# EAGLE design Single Turnoutv0.2 (EAGLE 8.2.2)
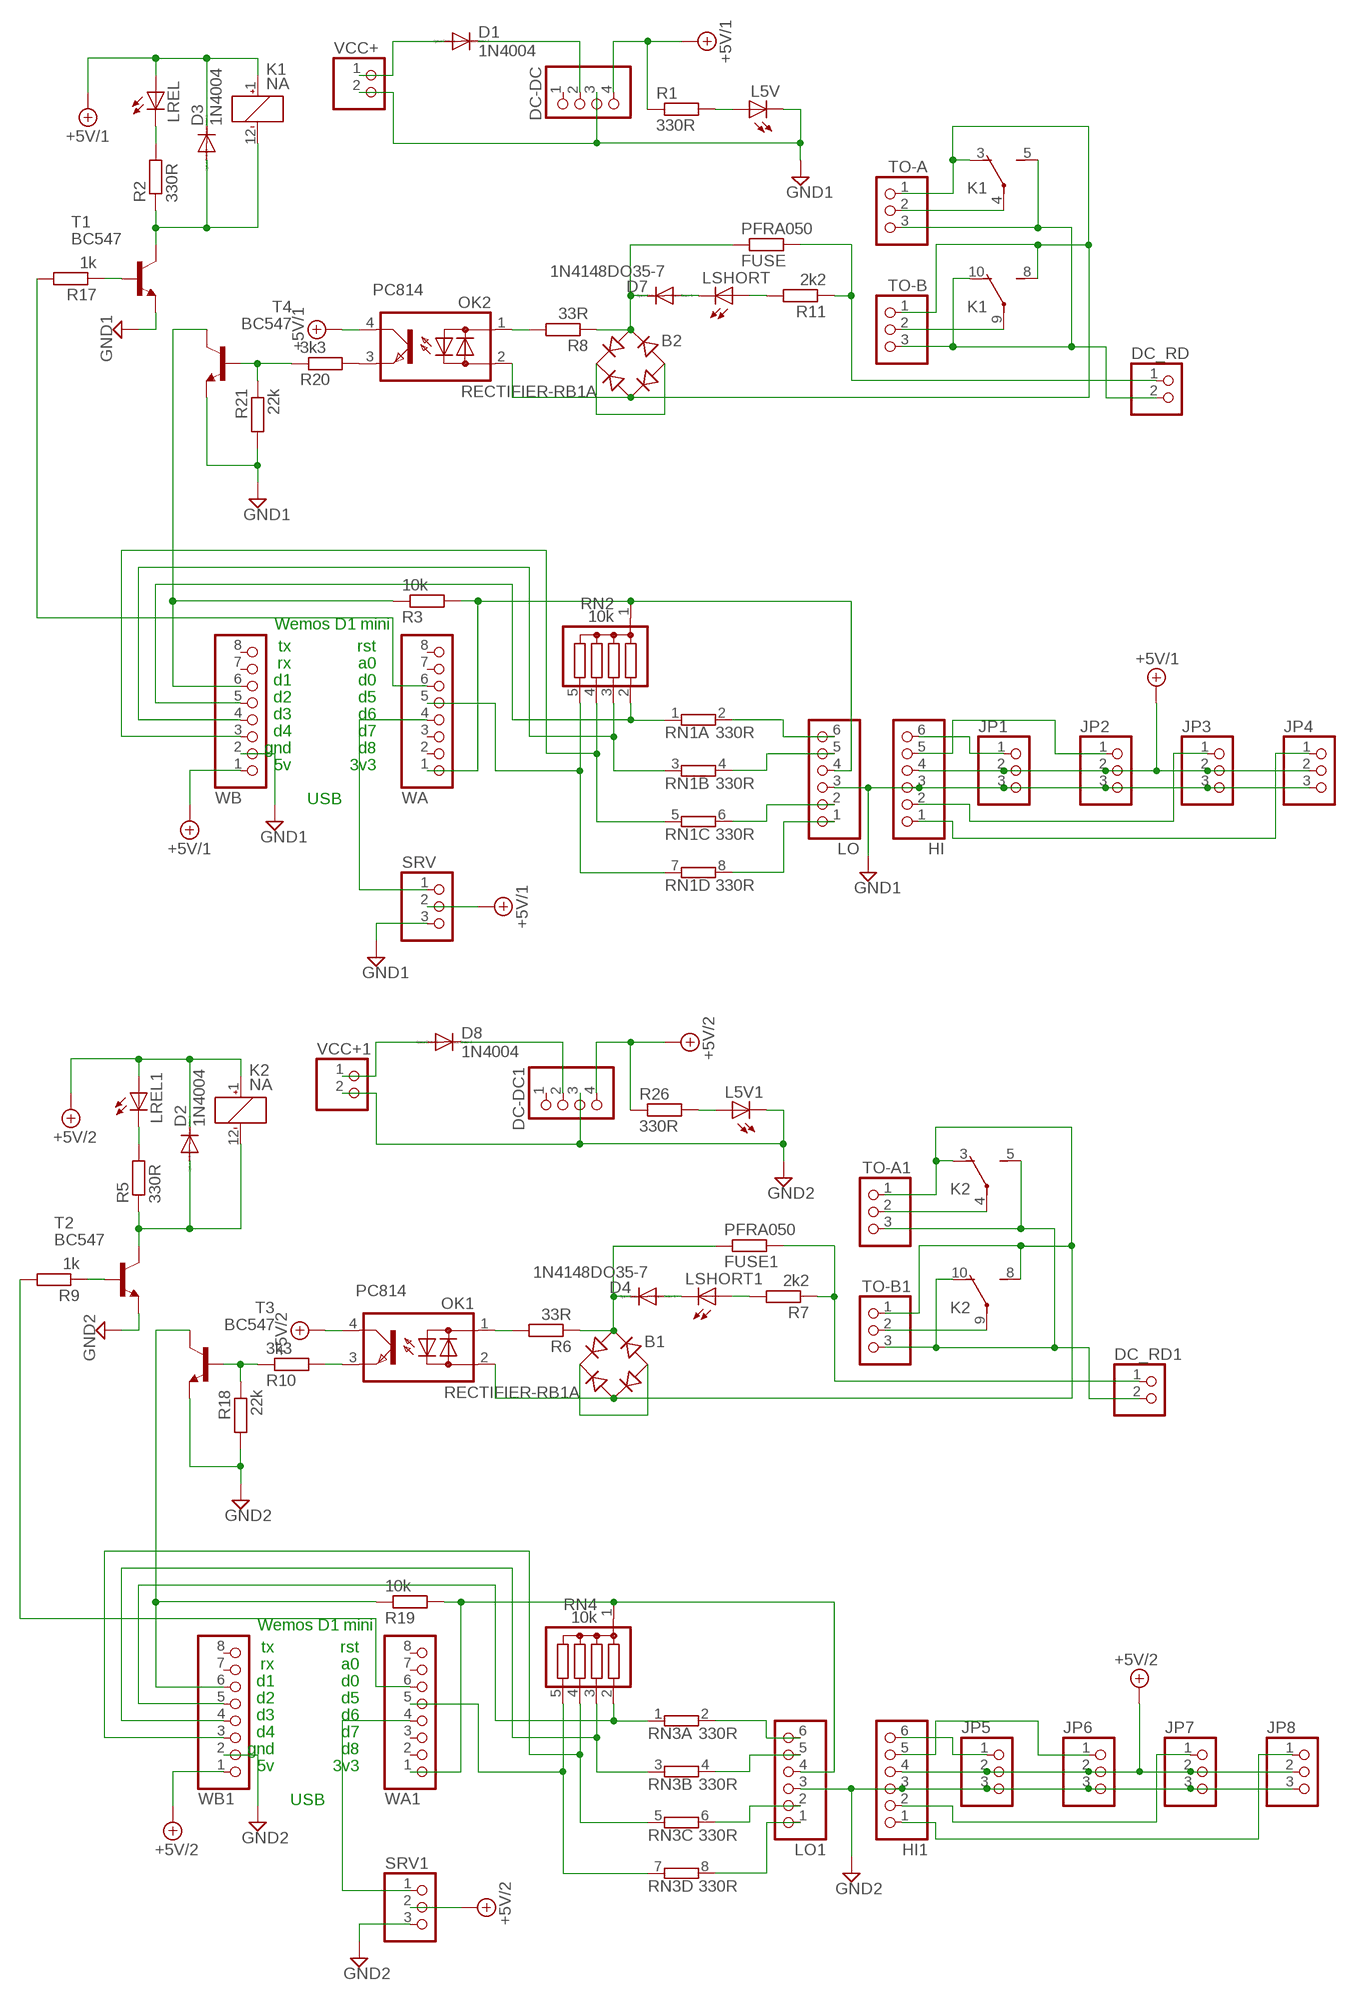
[diagram p0: schematic, sheet 1]

## Parts
B1  RECTIFIER-RB1A  [RB1A]
B2  RECTIFIER-RB1A  [RB1A]
D1  1N4004  [DO41-10]
D2  1N4004  [DO41-10]
D3  1N4004  [DO41-10]
D4  1N4148DO35-7  [DO35-7]
D7  1N4148DO35-7  [DO35-7]
D8  1N4004  [DO41-10]
DC-DC  PINHD-1X4  [1X04]
DC-DC1  PINHD-1X4  [1X04]
DC_RD  PINHD-1X2  [1X02]
DC_RD1  PINHD-1X2  [1X02]
FUSE  PFRA050  R-EU_0414/5V  [0414V]
FUSE1  PFRA050  R-EU_0414/5V  [0414V]
HI  PINHD-1X6  [1X06]
HI1  PINHD-1X6  [1X06]
JP1  PINHD-1X3  [1X03]
JP2  PINHD-1X3  [1X03]
JP3  PINHD-1X3  [1X03]
JP4  PINHD-1X3  [1X03]
JP5  PINHD-1X3  [1X03]
JP6  PINHD-1X3  [1X03]
JP7  PINHD-1X3  [1X03]
JP8  PINHD-1X3  [1X03]
K1  NA  [NA]
K2  NA  [NA]
L5V  LED3MM  [LED3MM]
L5V1  LED3MM  [LED3MM]
LO  PINHD-1X6  [1X06]
LO1  PINHD-1X6  [1X06]
LREL  LED3MM  [LED3MM]
LREL1  LED3MM  [LED3MM]
LSHORT  LED3MM  [LED3MM]
LSHORT1  LED3MM  [LED3MM]
OK1  PC814  [DIL04]
OK2  PC814  [DIL04]
R1  330R  R-EU_0207/7  [0207/7]
R2  330R  R-EU_0207/7  [0207/7]
R3  10k  R-EU_0207/7  [0207/7]
R5  330R  R-EU_0207/7  [0207/7]
R6  33R  R-EU_0207/7  [0207/7]
R7  2k2  R-EU_0207/7  [0207/7]
R8  33R  R-EU_0207/7  [0207/7]
R9  1k  R-EU_0207/7  [0207/7]
R10  3k3  R-EU_0207/7  [0207/7]
R11  2k2  R-EU_0207/7  [0207/7]
R17  1k  R-EU_0207/7  [0207/7]
R18  22k  R-EU_0207/7  [0207/7]
R19  10k  R-EU_0207/7  [0207/7]
R20  3k3  R-EU_0207/7  [0207/7]
R21  22k  R-EU_0207/7  [0207/7]
R26  330R  R-EU_0207/7  [0207/7]
RN1  330R  E4R  [SIL8]
RN2  10k  G04R  [SIL5]
RN3  330R  E4R  [SIL8]
RN4  10k  G04R  [SIL5]
SRV  PINHD-1X3  [1X03]
SRV1  PINHD-1X3  [1X03]
T1  BC547  [TO92]
T2  BC547  [TO92]
T3  BC547  [TO92]
T4  BC547  [TO92]
TO-A  PINHD-1X3  [1X03]
TO-A1  PINHD-1X3  [1X03]
TO-B  PINHD-1X3  [1X03]
TO-B1  PINHD-1X3  [1X03]
VCC+  PINHD-1X2  [1X02]
VCC+1  PINHD-1X2  [1X02]
WA  PINHD-1X8  [1X08]
WA1  PINHD-1X8  [1X08]
WB  PINHD-1X8  [1X08]
WB1  PINHD-1X8  [1X08]

## Nets
+5V/1 [5V]: D3.C DC-DC.4 HI.4 JP1.2 JP2.2 JP3.2 JP4.2 K1.1(1:+) LREL.A OK2.4(C) R1.1 SRV.2 WB.1
+5V/2 [5V]: D2.C DC-DC1.4 HI1.4 JP5.2 JP6.2 JP7.2 JP8.2 K2.1(1:+) LREL1.A OK1.4(C) R26.1 SRV1.2 WB1.1
GND1 [Gnd]: DC-DC.3 HI.3 JP1.3 JP2.3 JP3.3 JP4.3 L5V.K(C) LO.3 R21.2 SRV.3 T1.1(E) T4.1(E) VCC+.2 WB.2
GND2 [Gnd]: DC-DC1.3 HI1.3 JP5.3 JP6.3 JP7.3 JP8.3 L5V1.K(C) LO1.3 R18.2 SRV1.3 T2.1(E) T3.1(E) VCC+1.2 WB1.2
N$1 [3.3V]: LO.4 R3.2 RN2.1 WA.1
N$2: LO.6 RN1.2
N$3 [Rijstroom+]: DC_RD.1 FUSE.2 R11.1
N$4 [5V]: D1.A VCC+.1
N$5: R3.1 T4.3(C) WB.6
N$6: LREL1.K(C) R5.2
N$7: OK1.1(AC1) R6.2
N$8: LSHORT1.A R7.2
N$9: D4.A LSHORT1.K(C)
N$10: D2.A K2.12(1:-) R5.1 T2.3(C)
N$11: R9.1 T2.2(B)
N$12: LREL.K(C) R2.2
N$13 [Rijstroom+]: B1.+ B1.-
N$14 [Rijstroom+]: B2.AC2 K1.3(2:O) K1.8(3:S) OK2.2(AC2) TO-A.1 TO-B.1
N$15 [Rijstroom+]: K2.4(2:P) TO-A1.2
N$16 [Rijstroom-]: DC_RD.2 K1.5(2:S) K1.10(3:O) TO-A.3 TO-B.3
N$17: OK2.3(E) R20.2
N$18 [Rijstroom-]: K2.9(3:P) TO-B1.2
N$19 [Rijstroom+]: B1.AC2 K2.3(2:O) K2.8(3:S) OK1.2(AC2) TO-A1.1 TO-B1.1
N$20 [Rijstroom+]: B1.AC1 D4.C FUSE1.1 R6.1
N$21: OK2.1(AC1) R8.2
N$22 [Rijstroom-]: DC_RD1.2 K2.5(2:S) K2.10(3:O) TO-A1.3 TO-B1.3
N$23 [Rijstroom+]: B2.AC1 D7.C FUSE.1 R8.1
N$24: LO.5 RN1.4
N$25: HI.2 JP3.1
N$26 [Rijstroom+]: K1.4(2:P) TO-A.2
N$27 [Rijstroom+]: DC_RD1.1 FUSE1.2 R7.1
N$28: R20.1 R21.1 T4.2(B)
N$29: R17.2 WA.6
N$30: HI.5 JP2.1
N$31: SRV.1 WA.4
N$32 [Rijstroom-]: K1.9(3:P) TO-B.2
N$33: SRV1.1 WA1.4
N$34: R10.1 R18.1 T3.2(B)
N$35: LSHORT.A R11.2
N$36: HI.6 JP1.1
N$37: RN1.3 RN2.3 WB.4
N$38: RN1.1 RN2.2 WB.5
N$39: HI1.2 JP7.1
N$40: HI1.5 JP6.1
N$41: D7.A LSHORT.K(C)
N$42 [Rijstroom+]: B2.+ B2.-
N$43: HI1.6 JP5.1
N$44: RN1.5 RN2.4 WB.3
N$45: RN1.7 RN2.5 WA.5
N$46: L5V.A R1.2
N$47: RN3.5 RN4.4 WB1.3
N$48 [3.3V]: LO1.4 R19.2 RN4.1 WA1.1
N$49: R17.1 T1.2(B)
N$50: D3.A K1.12(1:-) R2.1 T1.3(C)
N$51: RN3.7 RN4.5 WA1.5
N$52: HI1.1 JP8.1
N$53: LO.2 RN1.6
N$54: RN3.3 RN4.3 WB1.4
N$55: RN3.1 RN4.2 WB1.5
N$56: LO.1 RN1.8
N$57: LO1.6 RN3.2
N$58 [5V]: D1.C DC-DC.2
N$59: LO1.5 RN3.4
N$60: LO1.2 RN3.6
N$61: HI.1 JP4.1
N$62: R9.2 WA1.6
N$63: OK1.3(E) R10.2
N$64: L5V1.A R26.2
N$65: R19.1 T3.3(C) WB1.6
N$66: LO1.1 RN3.8
N$67 [5V]: D8.A VCC+1.1
N$68 [5V]: D8.C DC-DC1.2
Unconnected: DC-DC1.1 DC-DC.1 WA1.2 WA1.3 WA1.7 WA1.8 WA.2 WA.3 WA.7 WA.8 WB1.7 WB1.8 WB.7 WB.8

## Notes on the sheet
- Wemos D1 mini
- tx | rst
- rx | a0
- d1 | d0
- d2 | d5
- d3 | d6
- d4 | d7
- gnd | d8
- 5v | 3v3
- USB
- Wemos D1 mini
- tx | rst
- rx | a0
- d1 | d0
- d2 | d5
- d3 | d6
- d4 | d7
- gnd | d8
- 5v | 3v3
- USB

## Library data of the parts
B1 B2 = rectifier:RECTIFIER-: Rectifier
D1-D3 D8 = diode:1N4004: DIODE general purpose rectifier, 1 A
D4 D7 = diode:1N4148: DIODE high speed (Philips)
DC-DC DC-DC1 = pinhead:PINHD-1X4: PIN HEADER
DC_RD DC_RD1 VCC+ VCC+1 = pinhead:PINHD-1X2: PIN HEADER
FUSE FUSE1 R1-R3 R5-R11 R17-R21 R26 = resistor:R-EU_: RESISTOR, European symbol
HI HI1 LO LO1 = pinhead:PINHD-1X6: PIN HEADER
JP1-JP8 SRV SRV1 TO-A TO-A1 TO-B TO-B1 = pinhead:PINHD-1X3: PIN HEADER
K1 K2 = relay:NA: RELAY; OC_FARNELL: unknown; OC_NEWARK: unknown
L5V L5V1 LREL LREL1 LSHORT LSHORT1 = led:LED: LED OSRAM: - CHIPLED LG R971, LG N971, LY N971, LG Q971, LY Q971, LO R971, LY R971 LH N974, LH R974 LS Q976, LO Q976, LY Q976 LO Q996 - Hyper CHIPLED LW Q18S LB Q993, LB Q99A, LB R99A - SideLED LS A670, LO A670, LY A670, LG A670, LP A670 LB A673, LV A673, LT A673, LW A673 LH A674 LY A675 LS A676, LA A676, LO A676, LY A676, LW A676 LS A679, LY A679, LG A679 - Hyper Micro SIDELED® LS Y876, LA Y876, LO Y876, LY Y876 LT Y87S - SmartLED LW L88C, LW L88S LB L89C, LB L89S, LG L890 LS L89K, LO L89K, LY L89K LS L896, LA L896, LO L896, LY L896 - TOPLED LS T670, LO T670, LY T670, LG T670, LP T670 LSG T670, LSP T670, LSY T670, LOP T670, LYG T670 LG T671, LOG T671, LSG T671 LB T673, LV T673, LT T673, LW T673 LH T674 LS T676, LA T676, LO T676, LY T676, LB T676, LH T676, LSB T676, LW T676 LB T67C, LV T67C, LT T67C, LS T67K, LO T67K, LY T67K, LW E67C LS E67B, LA E67B, LO E67B, LY E67B, LB E67C, LV E67C, LT E67C LW T67C LS T679, LY T679, LG T679 LS T770, LO T770, LY T770, LG T770, LP T770 LB T773, LV T773, LT T773, LW T773 LH T774 LS E675, LA E675, LY E675, LS T675 LS T776, LA T776, LO T776, LY T776, LB T776 LHGB T686 LT T68C, LB T68C - Hyper Mini TOPLED® LB M676 - Mini TOPLED Santana® LG M470 LS M47K, LO M47K, LY M47K Source: http://www.osram.convergy.de LUXEON: - LUMILED® LXK2-PW12-R00, LXK2-PW12-S00, LXK2-PW14-U00, LXK2-PW14-V00 LXK2-PM12-R00, LXK2-PM12-S00, LXK2-PM14-U00 LXK2-PE12-Q00, LXK2-PE12-R00, LXK2-PE12-S00, LXK2-PE14-T00, LXK2-PE14-U00 LXK2-PB12-K00, LXK2-PB12-L00, LXK2-PB12-M00, LXK2-PB14-N00, LXK2-PB14-P00, LXK2-PB14-Q00 LXK2-PR12-L00, LXK2-PR12-M00, LXK2-PR14-Q00, LXK2-PR14-R00 LXK2-PD12-Q00, LXK2-PD12-R00, LXK2-PD12-S00 LXK2-PH12-R00, LXK2-PH12-S00 LXK2-PL12-P00, LXK2-PL12-Q00, LXK2-PL12-R00 Source: www.luxeon.com KINGBRIGHT: KA-3528ASYC Source: www.kingbright.com
OK1 OK2 = optocoupler:PC814: SHARP OPTO COUPLER; OC_FARNELL: 9707662; OC_NEWARK: unknown
RN1 RN3 = resistor-sil:E4R: SIL RESISTOR; OC_FARNELL: unknown; OC_NEWARK: unknown
RN2 RN4 = resistor-sil:G04R: SIL RESISTOR; OC_FARNELL: unknown; OC_NEWARK: unknown
T1-T4 = transistor:BC547: NPN TRANSISTOR
WA WA1 WB WB1 = pinhead:PINHD-1X8: PIN HEADER

## Net classes
0 default: width 0.508 mm, clearance 0.254 mm
1 5V: width 0.762 mm, clearance 0.254 mm
2 Gnd: width 0.762 mm, clearance 0.254 mm
3 Extra: width 1.016 mm, clearance 0.254 mm
4 Rijstroom+: width 1.016 mm, clearance 0.254 mm
5 3.3V: width 0.508 mm, clearance 0.254 mm
6 Rijstroom-: width 1.016 mm, clearance 0.254 mm

## Board
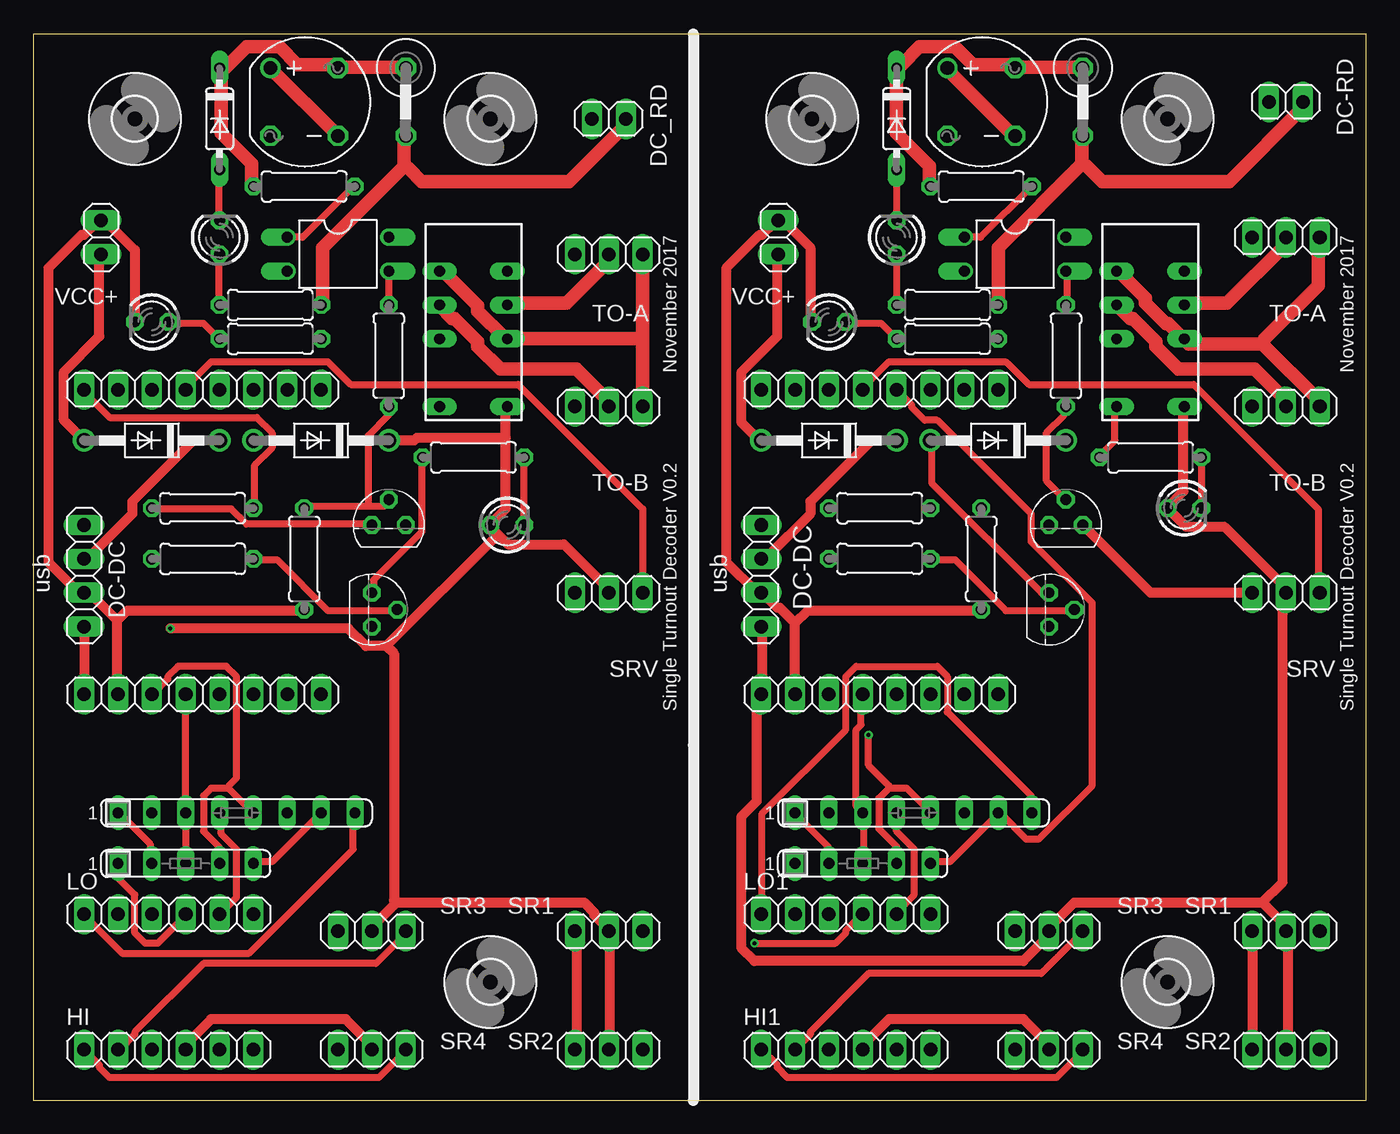
[diagram p1: board, top side]
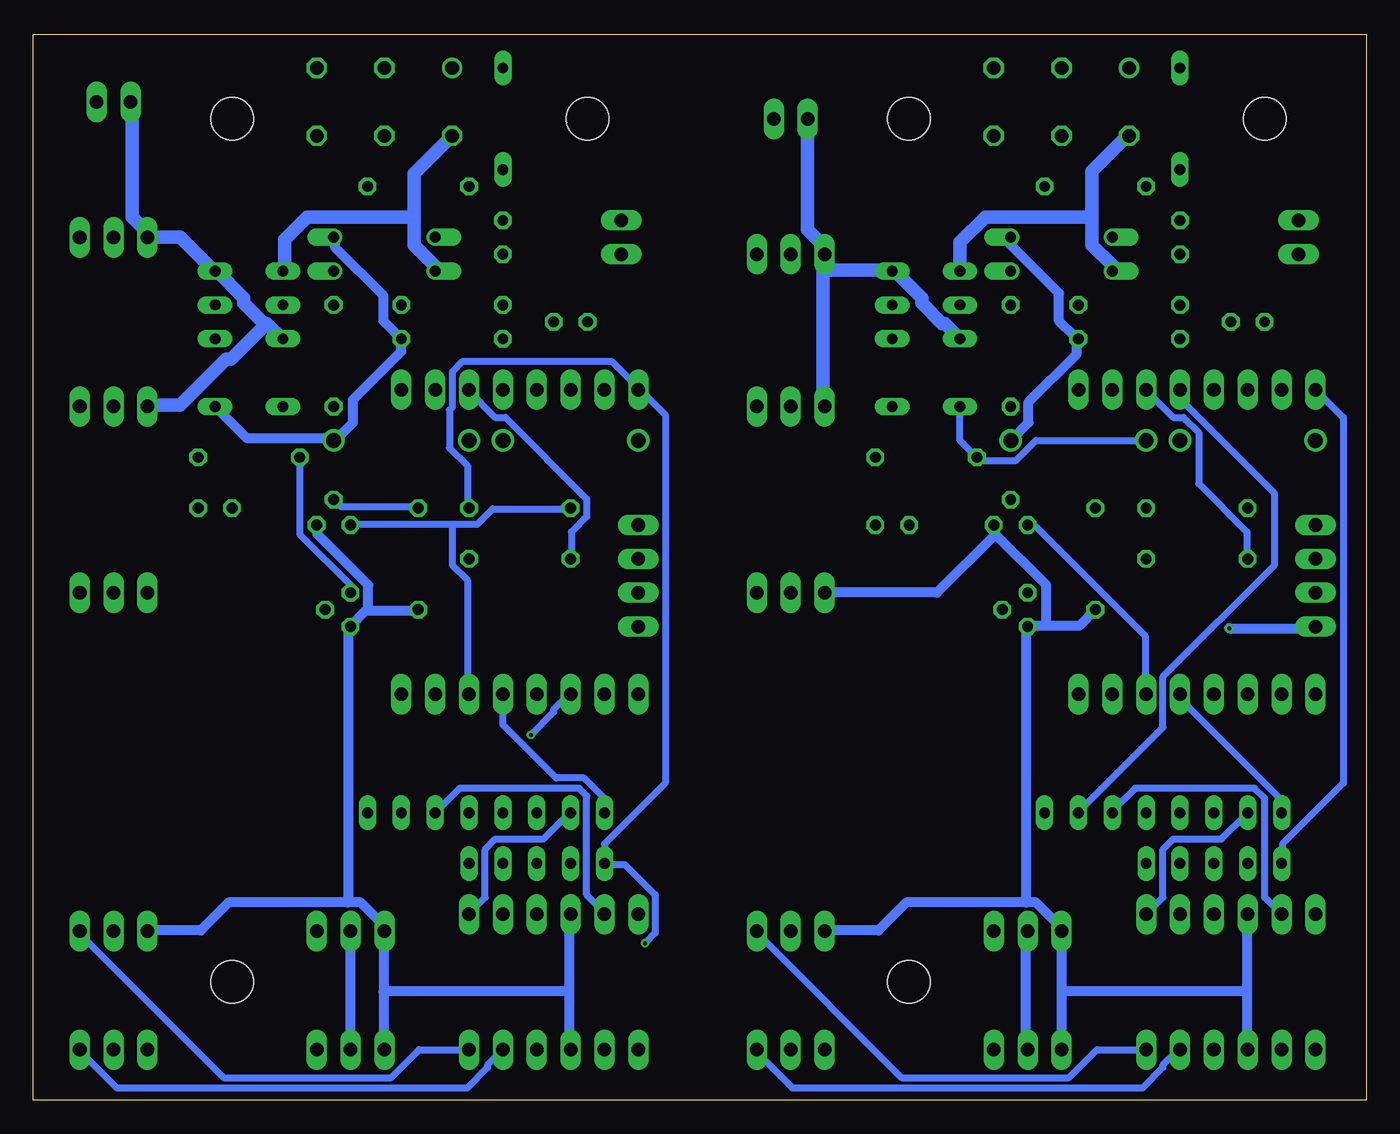
[diagram p2: board, bottom side, seen from below]

Size 100 x 80 mm. Coordinates in mm from the lower left corner, seen from the top.
Outline: 0,0 100,0 100,80 0,80 0,0
Copper layers (1*16): Top 0.035mm / dielectric 1.5mm / Bottom 0.035mm
Design rules "NOA Eagle Rule 2016-06-12": minimum track width 6mil, minimum drill 0.3mm, track to track 6mil, track to pad 6mil, pad to pad 6mil, via to via 6mil, smd to smd 0mil, copper to edge 0.4mm, drill to drill 10mil, minimum pad ring 10mil, minimum via ring 6mil, stop-mask expansion 2mil, vias tented up to drill 25mil, thermal gap 10mil

### Footprints (pad centres in the part's own frame; a part is rotated, then mirrored left to right if it is on the bottom)
RB1A = drill 1.016: + -2.54,2.54 | drill 1.016 octagon: - 2.54,-2.54; AC1 2.54,2.54; AC2 -2.54,-2.54
DO41-10 = drill 1.118: A 5.08,0; C -5.08,0
DO35-7 = drill 0.813 long: A 3.81,0; C -3.81,0
1X04 = drill 1.016 long: 1 -3.81,0; 2 -1.27,0; 3 1.27,0; 4 3.81,0
1X02 = drill 1.016 long: 1 -1.27,0; 2 1.27,0
0414V = drill 1.016 octagon: 1 -2.54,0; 2 2.54,0
1X06 = drill 1.016 long: 1 -6.35,0; 2 -3.81,0; 3 -1.27,0; 4 1.27,0; 5 3.81,0; 6 6.35,0
1X03 = drill 1.016 long: 1 -2.54,0; 2 0,0; 3 2.54,0
NA = drill 0.8 long: 1 -6.35,-2.54; 3 -1.27,-2.54; 4 1.27,-2.54; 5 3.81,-2.54; 8 3.81,2.54; 9 1.27,2.54; 10 -1.27,2.54; 12 -6.35,2.54
LED3MM = drill 0.813 octagon: A -1.27,0; K 1.27,0
DIL04 = drill 0.813 offset: 1 -1.27,-3.81; 2 1.27,-3.81; 3 1.27,3.81; 4 -1.27,3.81
0207/7 = drill 0.813 octagon: 1 -3.81,0; 2 3.81,0
SIL8 = drill 0.813 long: 1 -8.89,0; 2 -6.35,0; 3 -3.81,0; 4 -1.27,0; 5 1.27,0; 6 3.81,0; 7 6.35,0; 8 8.89,0
SIL5 = drill 0.813 long: 1 -5.08,0; 2 -2.54,0; 3 0,0; 4 2.54,0; 5 5.08,0
TO92 = drill 0.813 octagon: 1 1.27,0; 2 0,1.905; 3 -1.27,0
3,2 = hole 3.2: 0,0
1X08 = drill 1.016 long: 1 -8.89,0; 2 -6.35,0; 3 -3.81,0; 4 -1.27,0; 5 1.27,0; 6 3.81,0; 7 6.35,0; 8 8.89,0

### Placement (x,y rotation side)
B1  71.12,74.93 0 top
B2  20.32,74.93 0 top
D1  8.89,49.53 180 top
D2  72.39,49.53 180 top
D3  21.59,49.53 180 top
D4  64.77,73.66 270 top
D7  13.97,73.66 270 top
D8  59.69,49.53 180 top
DC-DC  3.81,39.37 270 top
DC-DC1  54.61,39.37 270 top
DC_RD  43.18,73.66 180 top
DC_RD1  93.98,74.93 180 top
FUSE  27.94,74.93 270 top
FUSE1  78.74,74.93 270 top
HI  10.16,3.81 0 top
HI1  60.96,3.81 0 top
JP1  43.18,12.7 180 top
JP2  43.18,3.81 180 top
JP3  25.4,12.7 180 top
JP4  25.4,3.81 180 top
JP5  93.98,12.7 180 top
JP6  93.98,3.81 180 top
JP7  76.2,12.7 180 top
JP8  76.2,3.81 180 top
K1  33.02,58.42 90 top
K2  83.82,58.42 90 top
L5V  8.89,58.42 180 top
L5V1  59.69,58.42 180 top
LO  10.16,13.97 0 top
LO1  60.96,13.97 0 top
LREL  35.56,43.18 0 top
LREL1  86.36,44.45 0 top
LSHORT  13.97,64.77 90 top
LSHORT1  64.77,64.77 90 top
OK1  73.66,63.5 270 top
OK2  22.86,63.5 270 top
R1  17.78,57.15 180 top
R2  33.02,48.26 0 top
R3  12.7,44.45 0 top
R5  83.82,48.26 0 top
R6  71.12,68.58 0 top
R7  68.58,59.69 180 top
R8  20.32,68.58 0 top
R9  63.5,40.64 180 top
R10  77.47,55.88 90 top
R11  17.78,59.69 180 top
R17  12.7,40.64 180 top
R18  71.12,40.64 270 top
R19  63.5,44.45 0 top
R20  26.67,55.88 90 top
R21  20.32,40.64 270 top
R26  68.58,57.15 180 top
RN1  15.24,21.59 0 top
RN2  11.43,17.78 0 top
RN3  66.04,21.59 0 top
RN4  62.23,17.78 0 top
SRV  43.18,38.1 180 top
SRV1  93.98,38.1 180 top
T1  25.4,36.83 270 top
T2  76.2,36.83 270 top
T3  77.47,43.18 0 top
T4  26.67,43.18 0 top
TO-A  43.18,63.5 180 top
TO-A1  93.98,64.77 180 top
TO-B  43.18,52.07 180 top
TO-B1  93.98,52.07 180 top
U$1  [3,2]  7.62,73.66 0 top
U$2  [3,2]  34.29,73.66 0 top
U$4  [3,2]  58.42,73.66 0 top
U$5  [3,2]  34.29,8.89 0 top
U$6  [3,2]  85.09,8.89 0 top
U$9  [3,2]  85.09,73.66 0 top
VCC+  5.08,64.77 90 top
VCC+1  55.88,64.77 90 top
WA  12.7,53.34 0 top
WA1  63.5,53.34 0 top
WB  12.7,30.48 0 top
WB1  63.5,30.48 0 top

### Tracks (layer width: path | path; a pad name or v marks a point on that pad's centre or on a via)
+5V/1  (via drill 0.3)
  Top 0.762: JP2.2 43.24,3.81 43.24,12.57 JP1.2 43.05,12.95 42.1,13.91 42.1,14.1 41.34,14.86 27.24,14.86 | HI.4 11.43,4.19 13.34,6.1 23.43,6.1 25.34,4.19 25.34,3.81 JP4.2 | 27.24,14.86 25.53,13.14 25.53,12.76 JP3.2 | DC-DC.4 WB.1 | 35.43,49.72 35.43,44.39 34.29,43.24 LREL.A 34.48,42.86 34.86,42.48 | 35.43,49.72 35.43,52.01 K1.1 | 34.86,42.48 35.62,41.72 39.81,41.72 43.05,38.48 43.05,38.1 SRV.2 | v10.29,35.43 23.62,35.43 24.96,34.1 26.48,34.1 | 34.86,42.48 26.48,34.1 | D3.C 28.57,49.53 28.77,49.72 35.43,49.72 | 26.48,34.1 27.05,33.53 27.05,15.05 27.24,14.86
  Bottom 0.762: JP3.2 25.53,12.57 25.53,3.81 JP4.2 | D3.C 25.34,50.86 25.34,52.39 21.72,56.01 21.72,57.15 R1.1 21.91,57.34 23.05,58.48 23.05,60.58 26.67,64.2 OK2.4 | v10.29,35.43 3.81,35.43 DC-DC.4
+5V/2
  Top 0.762: K2.1 86.3,52.01 86.3,45.72 85.15,44.58 LREL1.A 86.49,43.05 89.34,43.05 93.92,38.48 93.92,38.1 SRV1.2 93.73,37.91 93.73,16.38 92.2,14.86 | JP6.2 94.11,3.81 94.11,12.57 JP5.2 93.73,12.95 93.73,13.34 92.2,14.86 | DC-DC1.4 54.67,35.43 54.67,30.48 WB1.1 54.29,30.29 54.29,22.48 53.15,21.34 53.15,11.43 54.1,10.48 74.3,10.48 76.2,12.38 JP7.2 76.2,12.95 78.11,14.86 92.2,14.86 | JP8.2 76.2,4.19 74.3,6.1 64.2,6.1 62.29,4.19 62.29,3.81 HI1.4
  Bottom 0.762: OK1.4 77.34,64.77 77.34,64.01 73.72,60.39 73.72,58.48 R26.1 72.39,56.2 76.01,52.58 76.01,50.86 77.34,49.53 D2.C 77.72,49.72 84.01,49.72 K2.1 | JP8.2 JP7.2
GND1
  Top 0.762: JP2.3 40.77,3.81 40.77,12.57 JP1.3 | L5V.K 7.62,63.82 5.52,65.91 5.14,65.91 VCC+.2 4.76,65.91 3.81,64.96 3.62,64.96 1.14,62.48 1.14,40.39 3.62,37.91 DC-DC.3 4.19,38.1 6.29,36.01 | 6.29,36.01 6.29,30.48 WB.2 | 6.29,36.01 7.05,36.77 20.19,36.77 R21.2
  Bottom 0.762: 22.86,8.19 JP3.3 22.86,12.95 24.77,14.86 25.53,14.86 | 22.86,8.19 JP4.3 | 8.95,8.19 8.95,13.91 LO.3 | 8.95,8.19 8.95,3.81 HI.3 | 8.95,8.19 22.86,8.19 | 25.53,14.86 34.48,14.86 36.58,12.76 40.58,12.76 JP1.3 | 24,35.62 21.53,35.62 R21.2 | 24,35.62 25.34,35.62 T1.1 25.53,35.24 25.53,14.86 | 27.81,42.48 27.81,43.05 T4.1 | 27.81,42.48 24,38.67 24,35.62 | SRV.3 32.19,38.1 27.81,42.48
GND2
  Top 0.762: JP5.3 JP6.3 | SRV1.3 83.82,38.1 T3.1 | L5V1.K 58.29,58.48 58.29,64.01 56.39,65.91 56.01,65.91 VCC+1.2 55.63,65.91 54.67,64.96 54.48,64.96 52.01,62.48 52.01,40.39 54.29,38.1 DC-DC1.3 54.67,38.1 55.82,36.96 56.01,36.96 57.15,35.81 | WB1.2 57.15,35.81 | 57.15,35.81 58.1,36.77 71.06,36.77 R18.2
  Bottom 0.762: 73.72,8.19 73.72,12.57 JP7.3 73.53,12.95 75.44,14.86 76.39,14.86 | 73.72,8.19 73.72,3.81 JP8.3 | 59.82,8.19 59.82,13.91 LO1.3 | 59.82,8.19 59.82,3.81 HI1.3 | 59.82,8.19 73.72,8.19 | 76.39,14.86 85.34,14.86 87.44,12.76 91.44,12.76 JP5.3 | 74.87,36.77 75.06,36.77 76.2,35.62 T2.1 76.39,35.24 76.39,14.86 | 74.87,36.77 71.25,36.77 R18.2 | 74.87,36.77 74.87,38.67 78.68,42.48 78.68,43.05 T3.1
N$1
  Top 0.508: RN2.1 6.48,17.72 6.48,16.57 7.62,15.43 7.62,12.57 8.38,11.81 9.34,11.81 11.43,13.91 LO.4 | WA.1 3.81,53.15 5.71,51.24 16.76,51.24 17.91,50.1 17.91,48.96 16.57,47.62 16.57,44.58 R3.2
  Bottom 0.508: WA.1 1.71,51.24 1.71,23.81 6.29,19.24 6.29,17.91 RN2.1
N$2
  Bottom 0.508: RN1.2 10.86,19.62 14.48,19.62 15.24,18.86 15.24,15.24 LO.6
N$3
  Top 1.016: 27.81,70.1 21.72,64.01 21.72,59.82 R11.1 | 27.81,70.1 27.81,72.39 FUSE.2 | DC_RD.1 44.39,73.53 44.39,73.15 40.2,68.96 29.15,68.96 28.19,69.91 27.81,70.1
N$4
  Top 0.762: D1.A 2.29,51.05 2.29,54.67 4.95,57.34 4.95,63.44 VCC+.1
N$5
  Top 0.508: R3.1 8.95,44.39 14.86,44.39 16,43.24 25.34,43.24 T4.3
  Bottom 0.508: WB.6 16.57,30.48 16.57,34.86 24.77,43.05 25.34,43.05 T4.3
N$6
  Top 0.508: R5.2 LREL1.K
N$7
  Top 0.508: OK1.1 71.06,64.77 74.87,68.58 R6.2
N$8
  Top 0.508: LSHORT1.A R7.2
N$9
  Top 0.508: D4.A LSHORT1.K
N$10
  Top 0.508: K2.12 81.15,52.01 81.15,49.53 80.01,48.39 R5.1 | T2.3 75.63,38.1 67.44,46.29 67.44,49.53 D2.A
  Bottom 0.508: T2.3 76.2,38.67 80.01,42.48 R5.1
N$11
  Top 0.508: T2.2 78.11,36.77 72.96,36.77 69.15,40.58 67.44,40.58 R9.1
N$12
  Top 0.508: LREL.K 36.77,43.24 36.77,48.2 R2.2
N$13
  Top 1.016: B1.- 73.53,72.39 68.58,77.34 B1.+
N$14
  Top 1.016: K1.8 30.48,62.1 30.86,62.1 33.34,59.63 33.34,59.24 35.43,57.15 K1.3 45.72,57.15 | TO-A.1 45.72,57.15 | 45.72,57.15 TO-B.1
  Bottom 1.016: OK2.2 19.05,62.67 20.57,64.2 20.57,66.29 | 20.57,66.29 20.57,69.72 17.91,72.39 B2.AC2 | 20.57,66.29 28.57,66.29 30.48,64.39 K1.8
N$15
  Top 1.016: K2.4 86.49,59.82 89.53,59.82 93.92,64.2 93.92,64.77 TO-A1.2
N$16
  Bottom 1.016: K1.10 31.62,58.29 31.81,58.29 33.34,59.82 33.34,60.2 35.43,62.29 K1.5 36.01,62.29 40.39,62.29 TO-A.3 | TO-B.3 40.77,52.2 40.77,63.44 TO-A.3 | DC_RD.2 41.91,65.34 40.58,64.01 TO-A.3
N$17
  Top 0.508: OK2.3 R20.2
N$18
  Top 1.016: K2.9 82.3,58.67 82.49,58.67 84.2,56.96 84.2,56.58 85.92,54.86 91.63,54.86 93.92,52.58 93.92,52.2 TO-B1.2
N$19
  Top 1.016: K2.8 81.34,62.29 83.44,60.2 83.44,59.82 84.96,58.29 85.15,58.29 86.3,57.15 K2.3 86.68,56.77 92.2,56.77 | 92.2,56.77 96.39,52.58 96.39,52.2 TO-B1.1 | TO-A1.1 96.39,64.77 96.39,61.15 92.39,57.15 92.2,56.77
  Bottom 1.016: 71.44,66.29 71.44,69.53 B1.AC2 | 71.44,66.29 71.44,64.2 69.91,62.67 69.91,62.29 OK1.2 | 71.44,66.29 79.44,66.29 81.15,64.58 81.15,62.29 K2.8
N$20
  Top 1.016: FUSE1.1 78.68,77.53 73.72,77.53 B1.AC1 73.34,77.72 70.48,77.72 69.15,79.06 66.48,79.06 65.15,77.72 D4.C 64.77,72.58 67.25,70.1 67.25,68.58 R6.1
N$21
  Top 0.508: OK2.1 20.19,64.77 24,68.58 R8.2
N$22
  Bottom 1.016: 82.68,58.29 82.49,58.29 81.34,57.15 K2.10 | 82.68,58.29 84.2,59.82 84.2,60.2 86.3,62.29 K2.5 86.68,62.48 88.96,64.77 TO-A1.3 91.44,65.15 92.58,66.29 92.58,74.87 DC_RD1.2 | TO-B1.3 91.44,52.2 88.96,52.2 85.53,55.63 85.15,55.63 82.87,57.91 82.68,58.29
N$23
  Top 1.016: FUSE.1 27.81,77.53 22.86,77.53 B2.AC1 22.48,77.72 19.81,77.72 18.48,79.06 16,79.06 14.48,77.53 D7.C 14.1,77.34 14.1,72.58 16.38,70.29 16.38,68.58 R8.1
N$24
  Top 0.508: LO.5 15.24,15.24 15.24,18.86 14.1,20 14.1,21.53 RN1.4
N$25
  Top 0.508: HI.2 6.48,3.81 7.62,4.95 7.62,5.14 12.76,10.29 25.72,10.29 28,12.57 JP3.1
N$26
  Top 1.016: K1.4 35.62,59.82 40.01,59.82 43.05,62.87 43.05,63.44 TO-A.2
N$27
  Top 1.016: R7.1 72.39,64.01 78.68,70.29 | 78.68,70.29 78.68,72.39 FUSE1.2 | DC_RD1.1 95.25,74.49 89.72,68.96 80.2,68.96 79.06,70.1 78.68,70.29
N$28
  Top 0.508: 25.15,44.58 26.29,44.58 26.67,44.96 T4.2 | 25.15,44.58 20.38,44.58 R21.1 | R20.1 26.67,51.44 25.15,49.91 25.15,44.58
N$29
  Bottom 0.508: R17.2 8.95,40.77 8.95,42.67 12.57,46.29 12.57,50.1 13.72,51.24 14.48,51.24 16.57,53.34 WA.6
N$30
  Bottom 0.508: JP2.1 45.72,3.62 43.05,0.95 16.76,0.95 15.24,2.48 15.24,2.67 14.1,3.81 HI.5
N$31
  Top 0.508: SRV.1 45.72,44.39 36.39,53.72 23.81,53.72 22.1,55.44 13.34,55.44 11.43,53.53 WA.4
N$32
  Top 1.016: K1.9 30.48,59.63 31.43,58.67 31.62,58.67 33.34,56.96 33.34,56.58 35.05,54.86 40.77,54.86 43.05,52.58 43.05,52.2 TO-B.2
N$33
  Top 0.508: SRV1.1 96.39,38.1 96.39,44.39 87.06,53.72 74.68,53.72 72.96,55.44 64.2,55.44 62.1,53.34 WA1.4
N$34
  Top 0.508: R10.1 77.34,52.01 77.34,51.44 76.01,50.1 76.01,46.48 77.34,45.15 T3.2
  Bottom 0.508: T3.2 76.96,44.58 71.25,44.58 R18.1
N$35
  Top 0.508: R11.2 13.91,59.82 13.91,63.44 LSHORT.A
N$36
  Bottom 0.508: HI.6 20.19,3.81 22.29,1.71 34.86,1.71 45.72,12.57 JP1.1
N$37
  Top 0.508: RN2.3 RN1.3 WB.4
N$38
  Top 0.508: RN2.2 8.76,17.91 8.76,19.24 6.48,21.53 RN1.1
  Bottom 0.508: WB.5 13.91,30.48 13.91,30.1 6.48,22.67 6.48,21.72 RN1.1
N$39
  Top 0.508: HI1.2 58.29,4.95 58.29,5.14 62.67,9.53 75.63,9.53 78.68,12.57 JP7.1
N$40
  Bottom 0.508: HI1.5 65.91,2.67 65.91,2.48 67.44,0.95 93.73,0.95 96.58,3.81 JP6.1
N$41
  Top 0.508: LSHORT.K 13.91,66.1 13.91,69.72 D7.A
N$42
  Top 1.016: B2.+ B2.-
N$43
  Bottom 0.508: HI1.6 71.06,3.81 73.15,1.71 85.72,1.71 96.58,12.57 JP5.1
N$44
  Top 0.508: 14.67,23.43 13.34,23.43 12.76,22.86 12.76,20.19 13.91,19.05 13.91,17.91 RN2.4 | RN1.5 14.67,23.43 | WB.3 8.95,30.48 10.1,31.62 10.1,31.81 10.86,32.58 14.48,32.58 15.24,31.81 15.24,24.19 14.67,23.62 14.67,23.43
N$45
  Top 0.508: RN1.7 17.91,17.91 16.57,17.91 RN2.5
  Bottom 0.508: WA.5 13.91,53.34 13.91,52.58 6.86,45.53 6.86,40.2 15.24,31.81 15.24,28 21.53,21.72 RN1.7
N$46
  Top 0.508: L5V.A 10.29,58.29 12.76,58.29 13.91,57.15 R1.2
N$47  (via drill 0.3)
  Top 0.508: RN4.4 64.77,19.05 63.44,20.38 63.44,22.67 64.2,23.43 | 64.2,23.43 65.53,23.43 67.25,21.72 RN3.5 | v62.67,27.43 62.67,25.15 64.2,23.62 64.2,23.43
  Bottom 0.508: v62.67,27.43 60.96,29.15 60.96,29.34 59.82,30.48 WB1.3
N$48  (via drill 0.3)
  Top 0.508: v54.1,11.81 60.2,11.81 60.96,12.57 60.96,12.76 62.1,13.91 LO1.4
  Bottom 0.508: R19.2 67.44,44.58 67.44,47.62 68.77,48.96 68.77,51.82 68.58,52.01 68.58,54.67 67.82,55.44 56.58,55.44 54.67,53.53 WA1.1 54.48,53.34 52.58,51.44 52.58,23.81 57.15,19.24 RN4.1 56.96,17.72 55.63,17.72 53.34,15.43 53.34,12.57 v54.1,11.81
N$49
  Top 0.508: T1.2 27.24,36.77 22.1,36.77 18.29,40.58 16.57,40.58 R17.1
N$50
  Top 0.508: T1.3 25.53,38.1 25.53,39.05 29.15,42.67 29.15,48.2 R2.1
  Bottom 0.508: K1.12 30.48,49.53 R2.1 28.96,48.01 26.29,48.01 24.77,49.53 D3.A
N$51
  Top 0.508: RN4.5 67.44,17.91 68.77,17.91 72.39,21.53 RN3.7 72.58,21.53 74.49,19.62 75.44,19.62 79.44,23.62 79.44,37.34 74.87,41.91 74.87,44.01 67.82,51.05 66.86,51.05 65.91,52.01 65.91,52.2 WA1.5
N$52
  Top 0.508: HI1.1 54.67,3.81 55.82,2.67 55.82,2.48 56.58,1.71 76.77,1.71 78.87,3.81 JP8.1
N$53
  Bottom 0.508: LO.2 7.62,15.24 7.62,22.67 8.38,23.43 17.34,23.43 19.05,21.72 RN1.6
N$54
  Top 0.508: RN4.3 62.29,17.91 62.29,21.53 RN3.3 61.72,22.1 61.72,27.81 62.1,28.19 62.1,30.48 WB1.4
N$55
  Top 0.508: RN4.2 59.63,17.91 59.63,19.05 57.15,21.53 RN3.1
  Bottom 0.508: WB1.5 64.77,28.19 60.77,24.19 58.67,24.19 57.15,22.67 RN3.1
N$56
  Top 0.508: RN1.8 24,21.53 24,18.86 16.19,11.05 6.67,11.05 3.81,13.91 LO.1
N$57
  Bottom 0.508: RN3.2 59.82,21.53 61.72,19.62 65.34,19.62 66.1,18.86 66.1,15.24 67.25,14.1 LO1.6
N$58
  Top 0.762: D1.C 12,49.53 7.43,44.96 7.43,44.01 4.19,40.77 3.81,40.77 DC-DC.2
N$59
  Top 0.508: RN3.4 64.77,20.19 66.1,18.86 66.1,15.43 64.77,14.1 LO1.5
N$60
  Bottom 0.508: RN3.6 68.01,23.43 59.05,23.43 58.48,22.86 58.48,15.43 57.15,14.1 LO1.2
N$61
  Top 0.508: HI.1 4.95,2.67 4.95,2.48 5.71,1.71 25.91,1.71 28,3.81 JP4.1
N$62
  Bottom 0.508: R9.2 59.63,40.77 59.63,42.67 58.48,43.81 58.48,45.15 64.58,51.24 65.34,51.24 67.44,53.34 WA1.6
N$63
  Top 0.508: R10.2 77.53,59.82 77.53,62.1 OK1.3
N$64
  Top 0.508: R26.2 63.63,58.29 60.96,58.29 L5V1.A
N$65
  Bottom 0.508: 68.58,43.24 76.2,43.24 T3.3 | 68.58,43.24 66.67,43.24 65.53,44.39 59.82,44.39 R19.1 | 68.58,43.24 68.58,40.2 67.44,39.05 67.44,30.48 WB1.6
N$66
  Top 0.508: RN3.8 74.87,21.72 74.87,22.86 68.58,29.15 68.58,31.81 67.82,32.58 61.72,32.58 60.96,31.81 60.96,27.81 54.67,21.53 54.67,14.1 LO1.1
N$67
  Top 0.762: VCC+1.1 55.82,63.44 55.82,57.34 53.15,54.67 53.15,50.86 54.48,49.53 D8.A
N$68
  Top 0.762: D8.C 62.87,49.53 58.29,44.96 58.29,44.01 55.05,40.77 54.67,40.77 DC-DC1.2

### Text on the board
tNames: DC-RD | VCC+ | VCC+ | TO-A | TO-A | November 2017 | November 2017 | TO-B | TO-B | usb | usb | DC-DC | SRV | SRV | Single Turnout Decoder V0.2 | Single Turnout Decoder V0.2 | SR3 | SR1 | SR3 | SR1 | SR4 | SR2 | SR4 | SR2